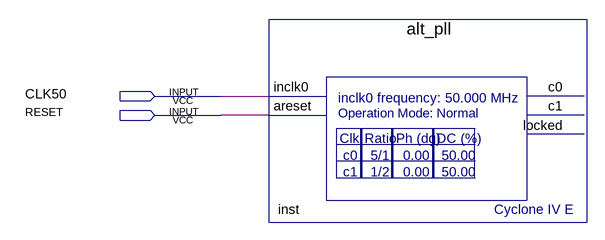
[diagram p0: schematic sheet]
// Quartus schematic serdes.bdf as structural Verilog: 1 symbols, 2 pins
module serdes (
  input  CLK50,
  input  RESET
);

  alt_pll inst (.inclk0(CLK50), .areset(RESET));  // open: c0, c1, locked
endmodule
